# EAGLE design mister_io_db9 (EAGLE 9.0.0)
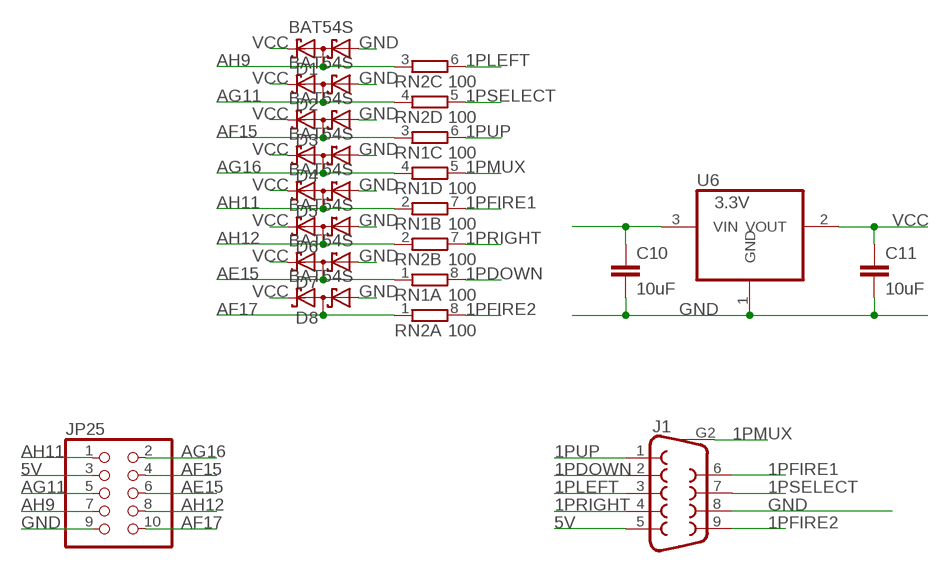
[diagram p0: schematic, sheet 1]

## Parts
C10  10uF  C-EUC0603K  [C0603K]
C11  10uF  C-EUC0603K  [C0603K]
D1  BAT54S  [SOT23]
D2  BAT54S  [SOT23]
D3  BAT54S  [SOT23]
D4  BAT54S  [SOT23]
D5  BAT54S  [SOT23]
D6  BAT54S  [SOT23]
D7  BAT54S  [SOT23]
D8  BAT54S  [SOT23]
J1  SPARKFUN-CONNECTORS_DB9MALE  [SPARKFUN-CONNECTORS_DB9_MALE]
JP25  PINHD-2X5  [2X05]
RN1  100  4R-N0603-ARC  [0603-ARC]
RN2  100  4R-N0603-ARC  [0603-ARC]
U6  3.3V  REG1117  [SOT223]

## Nets
1PDOWN: J1.2 RN1.8
1PFIRE1: J1.6 RN1.7
1PFIRE2: J1.9 RN2.8
1PLEFT: J1.3 RN2.6
1PMUX: J1.G2 RN1.5
1PRIGHT: J1.4 RN2.7
1PSELECT: J1.7 RN2.5
1PUP: J1.1 RN1.6
5V: C10.1 J1.5 JP25.3 U6.3(VIN)
AE15: D7.3(C1A2) JP25.6 RN1.1
AF15: D3.3(C1A2) JP25.4 RN1.3
AF17: D8.3(C1A2) JP25.10 RN2.1
AG11: D2.3(C1A2) JP25.5 RN2.4
AG16: D4.3(C1A2) JP25.2 RN1.4
AH9: D1.3(C1A2) JP25.7 RN2.3
AH11: D5.3(C1A2) JP25.1 RN1.2
AH12: D6.3(C1A2) JP25.8 RN2.2
GND [power]: C10.2 C11.2 D1.1(A1) D2.1(A1) D3.1(A1) D4.1(A1) D5.1(A1) D6.1(A1) D7.1(A1) D8.1(A1) J1.8 JP25.9 U6.1(GND)
VCC: C11.1 D1.2(C2) D2.2(C2) D3.2(C2) D4.2(C2) D5.2(C2) D6.2(C2) D7.2(C2) D8.2(C2) U6.2(VOUT)

## Library data of the parts
C10 C11 = rcl:C-EU: CAPACITOR, European symbol
D1-D8 = diode:BAT54S: Schottky Diodes Pin connection corrected 2011-05-04 Source: Fairchild .. BAT54.pdf
J1 = mister_io2:SPARKFUN-CONNECTORS_DB9: DB9 Connector Standard DB9 (D-Sub 9) serial connector. Can be used for CAN bus as well as RS485 and RS232. Footprint production proven. Here is the female version connector we sell at SparkFun: 9 Pin Female Serial Connector - PCB Mount <https://www.sparkfun.com/products/429> (PRT-00429) This connector has been used on the following SparkFun products: SparkFun RS232 Shifter - SMD <https://www.sparkfun.com/products/449> (PRT-00449) SparkFun RS232 Shifter SMD (No DB9) <https://www.sparkfun.com/products/8780> (PRT-08780); PROD_ID: CONN-09904
JP25 = pinhead:PINHD-2X5: PIN HEADER
RN1 RN2 = resistor-dil:4R-N: Array Chip Resistor Source: RS Component / Phycomp; OC_FARNELL: unknown; OC_NEWARK: unknown
U6 = burr-brown:REG1117: 800mA and 1A Low Dropout (LDO) Positive Regulator 1.8V, 2.5V, 2.85V, 3.3V, 5V, and Adj; MPN: REG1117; OC_FARNELL: 1097566; OC_NEWARK: 14P6981

## Net classes
0 default: width 0.178 mm, clearance 0.178 mm
1 power: width 0.305 mm, clearance 0.178 mm to class 0, clearance 0.229 mm

## Board
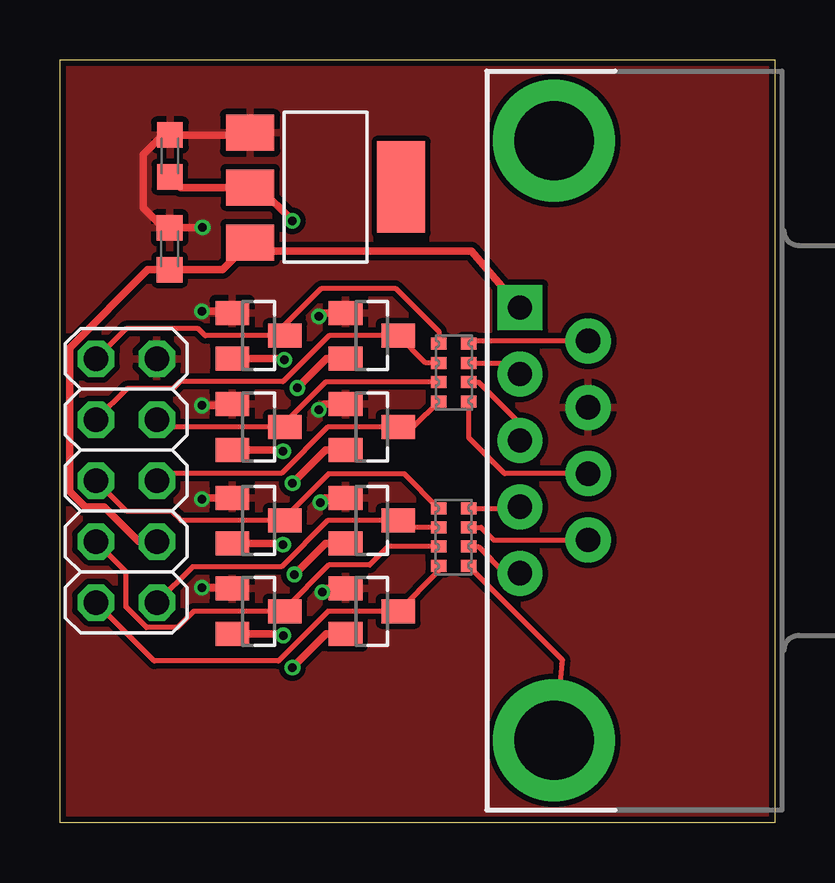
[diagram p1: board, top side]
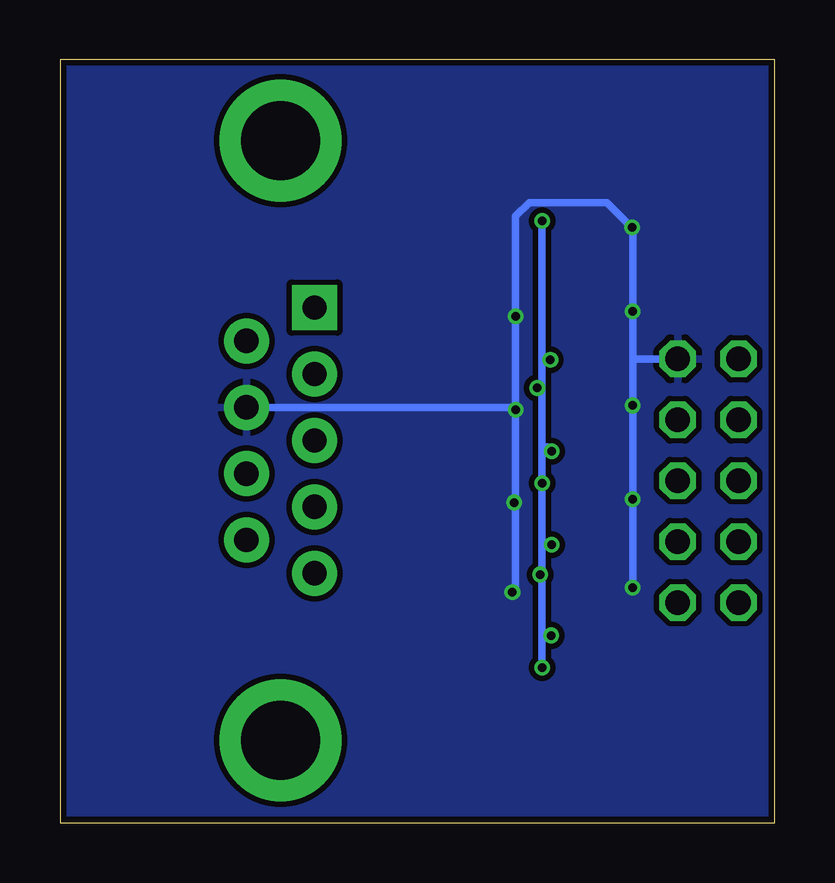
[diagram p2: board, bottom side, seen from below]

Size 29.79 x 31.8 mm. Coordinates in mm from the lower left corner, seen from the top.
Outline: 29.79,31.8 29.79,0 0,0 0,31.8 29.79,31.8
Copper layers (1*16): Top 0.035mm / dielectric 1.5mm / Bottom 0.035mm
Design rules "seedstudio_Fusion_eagle_rule_v1.1": minimum track width 6mil, minimum drill 12mil, track to track 6mil, track to pad 6mil, pad to pad 6mil, via to via 6mil, smd to smd 0mil, copper to edge 10mil, drill to drill 10mil, minimum pad ring 10mil, minimum via ring 6mil, stop-mask expansion 2mil, vias tented up to drill 100mil, thermal gap 10mil

### Footprints (pad centres in the part's own frame; a part is rotated, then mirrored left to right if it is on the bottom)
C0603K = smd 1.05 x 1.08: 1 -0.875,0; 2 0.875,0
SOT23 = smd 1 x 1.4: 1 -0.95,-1.1; 2 0.95,-1.1; 3 0,1.1
SPARKFUN-CONNECTORS_DB9_MALE = drill 1.016 pad 1.88: 1 5.54,-1.42; 2 2.77,-1.42; 3 0,-1.42; 4 -2.77,-1.42; 6 4.15,1.42; 7 1.38,1.42; 8 -1.38,1.42; 9 -4.15,1.42 | drill 1.016 pad 1.88 square: 5 -5.54,-1.42 | drill 3.302 pad 5.08: G1 -12.5,0; G2 12.5,0
2X05 = drill 1.016 octagon: 1 -5.08,-1.27; 2 -5.08,1.27; 3 -2.54,-1.27; 4 -2.54,1.27; 5 0,-1.27; 6 0,1.27; 7 2.54,-1.27; 8 2.54,1.27; 9 5.08,-1.27; 10 5.08,1.27
0603-ARC = smd 0.5 x 0.65: 1 -1.2,-0.625; 2 -0.4,-0.625; 3 0.4,-0.625; 4 1.2,-0.625; 5 1.2,0.625; 6 0.4,0.625; 7 -0.4,0.625; 8 -1.2,0.625
SOT223 = smd 1.499 x 2.007: 1 -2.261,-3.15; 2 0.025,-3.15; 3 2.311,-3.15 | smd 3.81 x 2.007: 4 0,3.15

### Placement (x,y rotation side)
C10  4.57,23.93 90 top
C11  4.58,27.8 90 top
D1  8.28,16.5 270 top
D2  13,16.5 270 top
D3  8.28,8.81 270 top
D4  13,8.81 270 top
D5  13,12.6 270 top
D6  13,20.31 270 top
D7  8.28,12.6 270 top
D8  8.28,20.31 270 top
J1  20.6,15.94 270 top
JP25  2.77,14.26 90 top
RN1  16.41,11.91 270 top
RN2  16.42,18.77 270 top
U6  11.07,26.5 270 top

### Tracks (layer width: path | path; a pad name or v marks a point on that pad's centre or on a via)
1PDOWN
  Top 0.203: RN1.8 19.12,13.11 J1.2
1PFIRE1
  Top 0.203: J1.6 18.09,11.79 17.56,12.31 RN1.7
1PFIRE2
  Top 0.203: J1.9 17.16,20.09 RN2.8
1PLEFT
  Top 0.203: RN2.6 17.46,18.37 19.18,16.65 J1.3
1PMUX
  Top 0.203: 20.94,6.8 20.93,6.64 | 20.93,6.64 J1.G2 | RN1.5 20.93,6.82 20.93,6.64
1PRIGHT
  Top 0.203: RN2.7 18.72,19.17 J1.4
1PSELECT
  Top 0.203: RN2.5 17.05,16.65 17.05,16.48 17.05,16.05 18.54,14.56 J1.7
1PUP
  Top 0.203: J1.1 18.55,10.4 | 18.55,10.4 18.42,10.4 | RN1.6 17.44,11.51 18.55,10.4
5V
  Top 0.305: J1.5 17.16,23.84 8.28,23.84 U6.3 6.78,23.05 C10.1 3.66,23.05 0.41,19.8 0.41,13.81 1.05,13.17 1.84,13.17 3.29,11.72 JP25.3
AE15
  Top 0.203: JP25.6 2.78,12.98 4.66,12.98 5.04,12.6 D7.3 9.38,12.73 11.19,14.54 14.35,14.54 RN1.1
AF15
  Top 0.203: JP25.4 2.76,10.46 2.76,8.99 3.61,8.14 4.9,8.14 5.58,8.81 D3.3 9.38,8.92 11.2,10.74 12.92,10.74 13.68,11.51 RN1.3
AF17
  Top 0.203: JP25.10 2.76,20.6 5.77,20.6 6.06,20.31 D8.3 9.38,20.76 10.91,22.29 13.99,22.29 15.8,20.48 RN2.1
AG11
  Top 0.203: JP25.5 4.34,14.57 9.23,14.57 11.16,16.5 13.95,16.5 D2.3 14.72,16.5 RN2.4
AG16
  Top 0.203: D4.3 11.18,8.81 9.11,6.74 3.94,6.74 JP25.2 | 14.39,8.81 D4.3 | D4.3 15.78,10.49 RN1.4
AH9
  Top 0.203: JP25.7 4.34,16.5 D1.3 9.38,16.68 11.07,18.37 RN2.3
AH11
  Top 0.203: D5.3 14.06,12.6 | 14.06,12.6 11.16,12.6 9.23,10.67 5.52,10.67 JP25.1 | RN1.2 14.35,12.31 14.06,12.6
AH12
  Top 0.203: JP25.8 2.79,18.1 4.71,18.1 5,18.39 9.3,18.39 11.21,20.31 D6.3 15.24,19.17 RN2.2
GND  (via drill 0.35)
  Top 0.305: D8.1 7.11,21.32 v5.92,21.32 | v5.92,9.8 7.14,9.8 D3.1 | D1.1 7.13,17.4 v5.92,17.4 | D7.1 5.98,13.55 v5.92,13.49 | U6.1 7.83,28.68 C11.2 4.29,28.68 3.47,27.85 3.47,25.64 4.31,24.8 C10.2 5.93,24.8 v5.94,24.82 | v10.93,9.62 11.08,9.76 D4.1 | D5.1 11.05,13.55 v10.86,13.35 | D2.1 11.02,17.45 v10.79,17.22 | D6.1 10.95,21.26 v10.79,21.11
  Bottom 0.305: 5.92,19.39 v5.92,21.32 5.92,24.79 v5.94,24.82 6.99,25.86 10.22,25.86 10.79,25.29 v10.79,21.11 v10.79,17.22 | 5.92,19.39 v5.92,17.4 v5.92,13.49 v5.92,9.8 | JP25.9 5.87,19.34 5.92,19.39 | v10.93,9.62 10.79,9.75 10.79,13.41 | v10.79,17.22 10.79,13.41 | v10.86,13.35 10.79,13.41 | J1.8 10.89,17.32 v10.79,17.22
  pour Bottom: 0.25,31.51 30.39,31.51 30.39,0.41 0.3,0.41 0.3,31.46
  pour Top: 0.25,31.51 30.39,31.51 30.39,0.41 0.3,0.41 0.3,31.46
VCC  (via drill 0.35)
  Top 0.305: C11.1 5.03,26.48 U6.2 8.31,26.48 v9.69,25.09 | v9.69,6.47 11.08,7.86 D4.2 | D3.2 9.26,7.86 v9.31,7.81 | D5.2 11.07,11.65 v9.77,10.35 | D7.2 9.24,11.65 v9.3,11.59 | D2.2 11.08,15.55 v9.69,14.16 | D1.2 9.24,15.55 v9.3,15.49 | D6.2 11.12,19.36 v9.89,18.13 | D8.2 9.3,19.36 v9.35,19.3
  Bottom 0.305: 9.69,19.39 9.69,18.17 | 9.69,18.17 9.69,15.66 | 9.69,15.66 v9.69,14.16 9.69,11.61 | 9.69,11.61 9.69,10.35 | 9.69,10.35 9.69,7.9 | 9.69,7.9 v9.69,6.47 | v9.31,7.81 9.4,7.9 9.69,7.9 | v9.77,10.35 9.69,10.35 | v9.3,11.59 9.31,11.61 9.69,11.61 | v9.3,15.49 9.47,15.66 9.69,15.66 | v9.89,18.13 9.74,18.13 9.69,18.17 | v9.35,19.3 9.44,19.39 9.69,19.39 | v9.69,25.09 9.69,19.39